# EAGLE schematic Top General (EAGLE 9.6.2)
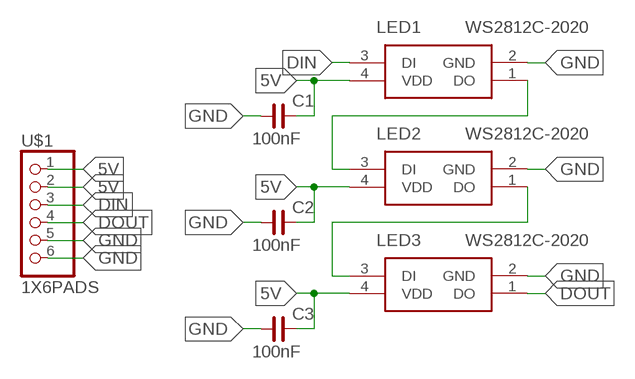
[diagram p0: schematic, sheet 1]

## Parts
C1  100nF  C_0402  [C0402]
C2  100nF  C_0402  [C0402]
C3  100nF  C_0402  [C0402]
LED1  WS2812C-2020  [WS2812C2020]
LED2  WS2812C-2020  [WS2812C2020]
LED3  WS2812C-2020  [WS2812C2020]
U$1  1X6PADS  [1X6PADS]

## Nets
5V: C1.2 C2.2 C3.2 LED1.4(VDD) LED2.4(VDD) LED3.4(VDD) U$1.1 U$1.2
DIN: LED1.3(DI) U$1.3
DOUT: LED3.1(DO) U$1.4
GND: C1.1 C2.1 C3.1 LED1.2(GND) LED2.2(GND) LED3.2(GND) U$1.5 U$1.6
N$1: LED1.1(DO) LED2.3(DI)
N$2: LED2.1(DO) LED3.3(DI)

## Library data of the parts
C1-C3 = rc-master-smd:C_: NON-POLARIZED CAP
LED1-LED3 = WS2812C-2020:WS2812C-2020: Intelligent control LED integrated light source Source: Datasheet <http://www.world-semi.com/DownLoadFile/139>; ARROW_PART_NUMBER: WS2812C-2020; DESCRIPTION: Intelligent control LED integrated light source; HEIGHT: 0.84mm; MANUFACTURER_NAME: Worldsemi; MANUFACTURER_PART_NUMBER: WS2812C-2020
U$1 = SMD Pads:1X6PADS